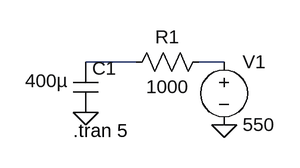
[diagram p0: schematic capacitor-precharge.asc]
capacitor-precharge.asc, the LTspice schematic file:
Version 4
SHEET 1 880 680
WIRE 192 160 128 160
WIRE 304 160 272 160
FLAG 128 224 0
FLAG 304 240 0
SYMBOL cap 112 160 R0
WINDOW 3 -61 24 Left 2
SYMATTR Value 400µ
SYMATTR InstName C1
SYMATTR SpiceLine IC=0V
SYMBOL res 288 144 R90
WINDOW 0 0 56 VBottom 2
WINDOW 3 32 56 VTop 2
SYMATTR InstName R1
SYMATTR Value 1000
SYMBOL voltage 304 144 R0
SYMATTR InstName V1
SYMATTR Value 550
TEXT 112 248 Left 2 !.tran 5

The netlist it stands for:
* capacitor-precharge.asc
C1 N001 0 400µ IC=0V
R1 N002 N001 1000
V1 N002 0 550
.tran 5
.backanno
.end